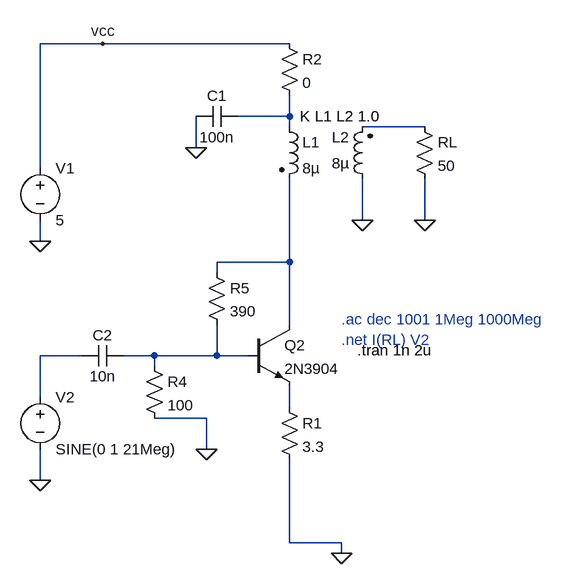
[diagram p0: schematic 10dbm_10dB_preamp.asc]
10dbm_10dB_preamp.asc, the LTspice schematic file:
Version 4
SHEET 1 964 816
WIRE -48 16 -144 16
WIRE 240 16 -48 16
WIRE 240 128 240 96
WIRE 240 128 160 128
WIRE 240 144 240 128
WIRE 448 144 352 144
WIRE 96 176 96 128
WIRE -144 208 -144 16
WIRE 352 288 352 224
WIRE 448 288 448 224
WIRE -144 320 -144 288
WIRE 240 352 240 224
WIRE 240 352 128 352
WIRE 128 368 128 352
WIRE 240 448 240 352
WIRE -80 496 -144 496
WIRE 32 496 -16 496
WIRE 128 496 128 448
WIRE 128 496 32 496
WIRE 176 496 128 496
WIRE 32 512 32 496
WIRE -144 560 -144 496
WIRE 240 576 240 544
WIRE 112 592 32 592
WIRE 112 640 112 592
WIRE -144 688 -144 640
WIRE 240 784 240 656
WIRE 320 784 240 784
WIRE 320 800 320 784
FLAG 320 800 0
FLAG 112 640 0
FLAG 96 176 0
FLAG -48 16 vcc
FLAG -144 688 0
FLAG 352 288 0
FLAG 448 288 0
FLAG -144 320 0
DATAFLAG 160 496 "$"
DATAFLAG 240 576 "$"
DATAFLAG 176 128 "$"
SYMBOL npn 176 448 R0
SYMATTR InstName Q2
SYMATTR Value 2N3904
SYMBOL voltage -144 192 R0
SYMATTR InstName V1
SYMATTR Value 5
SYMBOL voltage -144 544 R0
SYMATTR InstName V2
SYMATTR Value SINE(0 1 21Meg)
SYMATTR Value2 AC 1
SYMATTR SpiceLine Rser=50
SYMBOL cap 160 112 R90
WINDOW 0 0 32 VBottom 2
WINDOW 3 32 32 VTop 2
SYMATTR InstName C1
SYMATTR Value 100n
SYMBOL cap -16 480 R90
WINDOW 0 0 32 VBottom 2
WINDOW 3 32 32 VTop 2
SYMATTR InstName C2
SYMATTR Value 10n
SYMBOL ind2 224 128 R0
SYMATTR InstName L1
SYMATTR Value 8µ
SYMATTR Type ind
SYMBOL ind2 368 240 R180
WINDOW 0 36 80 Left 2
WINDOW 3 36 40 Left 2
SYMATTR InstName L2
SYMATTR Value 8µ
SYMATTR Type ind
SYMBOL res 224 560 R0
SYMATTR InstName R1
SYMATTR Value 3.3
SYMBOL res 224 0 R0
SYMATTR InstName R2
SYMATTR Value 0
SYMBOL res 16 496 R0
SYMATTR InstName R4
SYMATTR Value 100
SYMBOL res 432 128 R0
SYMATTR InstName RL
SYMATTR Value 50
SYMBOL res 112 352 R0
SYMATTR InstName R5
SYMATTR Value 390
TEXT 256 128 Left 2 !K L1 L2 1.0
TEXT 320 440 Left 2 ;.ac dec 1001 1Meg 1000Meg\n.net I(RL) V2
TEXT 344 488 Left 2 !.tran 1n 2u

The netlist it stands for:
* 10dbm_10dB_preamp.asc
Q2 N003 N005 N006 0 2N3904
V1 vcc 0 5
V2 N004 0 SINE(0 1 21Meg) AC 1 Rser=50
C1 N001 0 100n
C2 N005 N004 10n
L1 N001 N003 8µ
L2 0 N002 8µ
R1 N006 0 3.3
R2 vcc N001 0
R4 N005 0 100
RL N002 0 50
R5 N003 N005 390
.model NPN NPN
.model PNP PNP
.lib standard.bjt
K L1 L2 1.0
* .ac dec 1001 1Meg 1000Meg
* .net I(RL) V2
.tran 1n 2u
.backanno
.end